# Altium project 02-lm317-adjustable.PrjPcb
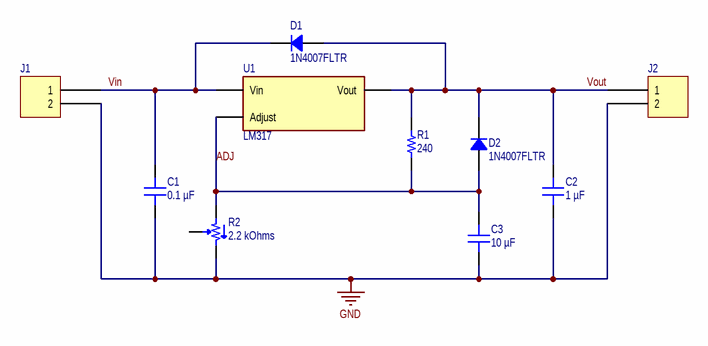
[diagram p0: lm317-adjustable.SchDoc]
1 sheet, 10 parts. Net scope: global (net labels, ports and power ports of the same name join across sheets).
Board file: lm317-adjustable.PcbDoc

## Sheet lm317-adjustable.SchDoc
size 420 x 297 mm; Author: ALTIUM GOSTBOM2.0 KEV; SheetNumber: 1; SheetTotal: 1

### Parts
C1  0.1 µF  [CAP 0805_2012]
C2  1 µF  [CAP 0805_2012]
C3  10 µF  [CAP 0805_2012]
D1  1N4007FLTR  [SOD123F]
D2  1N4007FLTR  [SOD123F]
J1  282837-2  [TE 282837-2]  (value not drawn)
J2  282837-2  [TE 282837-2]  (value not drawn)
R1  240  [RES 0805_2012]
R2  2.2 kOhms  [POT BOURNS TRIMPOT TC33]
U1  LM317  [FP-369C-MFG]

### Nets
GND: C1.1 C2.1 C3.1 J1.2 J2.2 R2.3
ADJ: C3.2 D2.1 R1.1 R2.1 U1.1(Adjust)
Vin: C1.2 D1.2 J1.1 U1.3(Vin)
Vout: C2.2 D1.1 D2.2 J2.1 R1.2 U1.4(Vout)

Not connected (* = marked no-connect by the designer): R2 2

### Notes on the sheet
- Перв. примен.
- Справ. №
- Подп. дата
- Инв. № дубл.
- Взам. инв. №
- Подп. и дата
- Изм.
- Разраб.
- Лист
- № докум.
- Подп.
- Дата
- Лит.
- Масса
- Масштаб
- Пров.
- Т.контр.
- Листов
- Инв. № подл.
- Н.контр.
- Утв.
- ALTIUM GOSTBOM2.0 KEV
- Файл:
- Копировал
- Формат А3

### Library data of the parts
C1 = CC0805MRX7R9BB104: CAP CER 0.1UF 50V X7R 0805; manufacturer: Yageo; Tolerance: ±20%; Part Number: CC0805MRX7R9BB104; Capacitance: 0.1 µF; Applications: General Purpose; componentlink1description: Datasheet; componentlink1url: https://www.yageo.com/upload/media/product/productsearch/datasheet/mlcc/UPY-GPHC_X7R_6.3V-to-50V_18.pdf; componentlink2description: DigiKey Link; componentlink2url: https://www.digikey.com/en/products/detail/yageo/CC0805MRX7R9BB104/5884281; Device Package: 0805 (2012 Metric); lastupdated: 06.04.2026 19:33:19; Lifecycle Status: Active; Minimum Order: 1; Mounting Type: Surface Mount, MLCC; Operating Temperature: -55°C ~ 125°C; Package / Case: 0805 (2012 Metric); packaging: TapeAndReel; partid: 2475; Part Status: Active; price: 0.01; series: CC; Size / Dimension: 0.079" L x 0.049" W (2.00mm x 1.25mm); Supplier 1: DigiKey; Supplier Part Number 1: 311-4351-1-ND; Temperature Coefficient: X7R; Thickness (Max): 0.037" (0.95mm); value: 0.1 µF; Voltage - Rated: 50V
C2 = GCJ21BR71H105KA01L: CAP CER 1UF 50V X7R 0805; manufacturer: Murata Electronics; Tolerance: ±10%; Part Number: GCJ21BR71H105KA01L; Capacitance: 1 µF; Applications: Automotive, Boardflex Sensitive; componentlink1description: Datasheet; componentlink1url: https://www.murata.com/~/media/webrenewal/support/library/catalog/products/capacitor/mlcc/c03e.ashx?la=en-us; componentlink2description: DigiKey Link; componentlink2url: https://www.digikey.com/en/products/detail/murata-electronics/GCJ21BR71H105KA01L/4903512; Device Package: 0805 (2012 Metric); Features: Soft Termination; lastupdated: 06.04.2026 19:33:18; Lifecycle Status: Active; Minimum Order: 1; Mounting Type: Surface Mount, MLCC; Operating Temperature: -55°C ~ 125°C; Package / Case: 0805 (2012 Metric); packaging: TapeAndReel; partid: 2709; Part Status: Active; price: 0.05; Ratings: AEC-Q200; series: GCJ; Size / Dimension: 0.079" L x 0.049" W (2.00mm x 1.25mm); Supplier 1: DigiKey; Supplier Part Number 1: 490-10667-1-ND; Temperature Coefficient: X7R; Thickness (Max): 0.057" (1.45mm); value: 1 µF; Voltage - Rated: 50V
C3 = GRM21BR61E106MA73L: CAP CER 10UF 25V X5R 0805; manufacturer: Murata Electronics; Tolerance: ±20%; Part Number: GRM21BR61E106MA73L; Capacitance: 10 µF; Applications: General Purpose; componentlink1description: Datasheet; componentlink1url: https://search.murata.co.jp/Ceramy/image/img/A01X/G101/ENG/GRM21BR61E106MA73-01.pdf; componentlink2description: DigiKey Link; componentlink2url: https://www.digikey.com/en/products/detail/murata-electronics/GRM21BR61E106MA73L/4905533; Device Package: 0805 (2012 Metric); lastupdated: 06.04.2026 19:32:54; Lifecycle Status: Active; Minimum Order: 1; Mounting Type: Surface Mount, MLCC; Operating Temperature: -55°C ~ 85°C; Package / Case: 0805 (2012 Metric); packaging: TapeAndReel; partid: 9882; Part Status: Active; price: 0.03; series: GRM; Size / Dimension: 0.079" L x 0.049" W (2.00mm x 1.25mm); Supplier 1: DigiKey; Supplier Part Number 1: 490-10748-1-ND; Temperature Coefficient: X5R; Thickness (Max): 0.055" (1.40mm); value: 10 µF; Voltage - Rated: 25V
D1 D2 = 1N4007FLTR: STANDARD RECTIFIER 1000V SOD-123; Manufacturer: SMC Diode Solutions; Capacitance @ Vr, F: 15pF @ 4V, 1MHz; Current - Average Rectified (Io): 1A; Current - Reverse Leakage @ Vr: 5µA @ 1000V; Speed: Standard Recovery >500ns, > 200mA (Io); Voltage - Forward (Vf) (Max) @ If: 1.1V @ 1A; Part Number: 1N4007FLTR; ComponentLink1Description: Datasheet; ComponentLink1URL: http://www.smc-diodes.com/propdf/1N4001FL-1N4007FL%20N1646%20REV.A.pdf; ComponentLink2Description: DigiKey Link; ComponentLink2URL: http://digikey.com/product-detail/en/smc-diode-solutions/1N4007FLTR/1655-1N4007FLCT-ND/11657827; Diode Type: Standard; LastUpdated: 30.08.2020 20:59:55; Lifecycle Status: Active; Minimum Order: 1; Mounting Type: Surface Mount; Package / Case: SOD-123F; Packaging: TapeAndReel; PartId: 3314; Price: 0.01; Supplier 1: DigiKey; Supplier Part Number 1: 1655-1N4007FLCT-ND; Supplier Device Package: SOD-123FL; Voltage - DC Reverse (Vr) (Max): 1000V
J1 J2 = 282837-2: TERM BLK 2P SIDE ENT 5.08MM PCB; Manufacturer: TE Connectivity AMP Connectors; Current: 13.5 A; Mating Orientation: Horizontal with Board; Number of Levels: 1; Pitch: 0.200" (5.08mm); Positions Per Level: 2; Voltage: 300 V; Wire Gauge: 16-28 AWG; Wire Termination: Screw - Rising Cage Clamp; Part Number: 282837-2; Color: Green; ComponentLink1Description: Datasheet; ComponentLink1URL: https://www.te.com/commerce/DocumentDelivery/DDEController?Action=srchrtrv&DocNm=282837&DocType=Customer+Drawing&DocLang=English; ComponentLink2Description: DigiKey Link; ComponentLink2URL: https://www.digikey.com/en/products/detail/te-connectivity-amp-connectors/282837-2/2187973; Features: Interlocking (Side); LastUpdated: 21.06.2022 15:00:23; Lifecycle Status: Active; Minimum Order: 1; Mounting Type: Through Hole; Packaging: Tray; Part Status: Active; Price: 0.31; Series: Buchanan; Supplier 1: DigiKey; Supplier Part Number 1: A113320-ND
R1 = ERJ-PB6D2400V: RES SMD 240 OHM 0.5% 1/4W 0805; Manufacturer: Panasonic Electronic Components; Power (Watts): 0.25W, 1/4W; Resistance: 240 Ohms; Temperature Coefficient: ±50ppm/°C; Part Number: ERJ-PB6D2400V; Value: 240; ComponentLink1Description: Datasheet; ComponentLink1URL: https://industrial.panasonic.com/cdbs/www-data/pdf/RDM0000/AOA0000C328.pdf; ComponentLink2Description: DigiKey Link; ComponentLink2URL: https://www.digikey.com/en/products/detail/panasonic-electronic-components/ERJ-PB6D2400V/6213729; Composition: Thick Film; Device Package: 0805 (2012 Metric); Features: Automotive AEC-Q200; Height - Seated (Max): 0.028" (0.70mm); LastUpdated: 05.04.2026 20:11:26; Lifecycle Status: Active; Minimum Order: 1; Number of Terminations: 2; Operating Temperature: -55°C ~ 155°C; Package / Case: 0805 (2012 Metric); Packaging: TapeAndReel; PartId: 27745; Part Status: Active; Price: 0.02; Ratings: AEC-Q200; Series: ERJ-PB6; Size / Dimension: 0.079" L x 0.049" W (2.00mm x 1.25mm); Supplier 1: DigiKey; Supplier Part Number 1: P20946CT-ND; Supplier Device Package: 0805; Tolerance: ±0.5%
R2 = TC33X-J-222E: TRIMMER 2.2K OHM 0.1W J LEAD TOP; Manufacturer: Bourns Inc.; Adjustment Type: Top Adjustment; Number of Turns: 1; Power (Watts): 0.1W, 1/10W; Resistive Material: Cermet; Temperature Coefficient: ±250ppm/°C; Tolerance: ±25%; Part Number: TC33X-J-222E; ComponentLink2Description: DigiKey Link; ComponentLink2URL: http://digikey.com/product-detail/en/bourns-inc/TC33X-J-222E/TC33X-J-222E-ND/6163999; LastUpdated: 30.08.2020 21:01:56; Lifecycle Status: Active; Minimum Order: 0; Mounting Type: Surface Mount; PartId: 29; Price: 0; Resistance: 2.2 kOhms; Series: Trimpot® TC33 - Open Frame; Size / Dimension: Rectangular - 0.150" x 0.142" Face x 0.047" H (3.80mm x 3.60mm x 1.20mm); Supplier 1: DigiKey; Supplier Part Number 1: TC33X-J-222E-ND; Termination Style: J Lead; Value: 2.2 kOhms
U1 = CMP-00278-01440164-1: LM317MADTRKG Linear Voltage Regulator, 500 mA, High PSRR, Adjustable, Positive Vout: 2%; TJ = 0°C to 125°C; Manufacturer Lifecycle Status: ACTIVE; Output Voltage: 37V; Max Input Voltage: 40V; Number of Outputs: 1; Reference Voltage: 1.275V; Output Current: 500mA; Max Output Current: 250mA; Min Output Voltage: 1.2V; Lead Free: Lead Free; Output Voltage Accuracy: 2%; Polarity: Positive; RoHS: Compliant; Accuracy: 2%; Contact Plating: Tin; Schedule B: 8542390000, 8542390000; Lifecycle Status: Production; Number of Channels: 1; Min Operating Temperature: 0°C; Packaging: Cut Tape (CT); Min Input Voltage: 40V; Radiation Hardening: No; Number of Regulators: 1; NexarPartId: 1440164; Output Type: Adjustable; Max Operating Temperature: 125°C; Number of Pins: 3; REACH SVHC: No SVHC; Max Output Voltage: 37V; Case/Package: DPAK; Halogen Free: Halogen Free; Mount: Surface Mount